# Altium schematic sheet POWER.SchDoc: TP5100, POWER PATH
size 420 x 297 mm; SheetNumber: 2; SheetTotal: 8
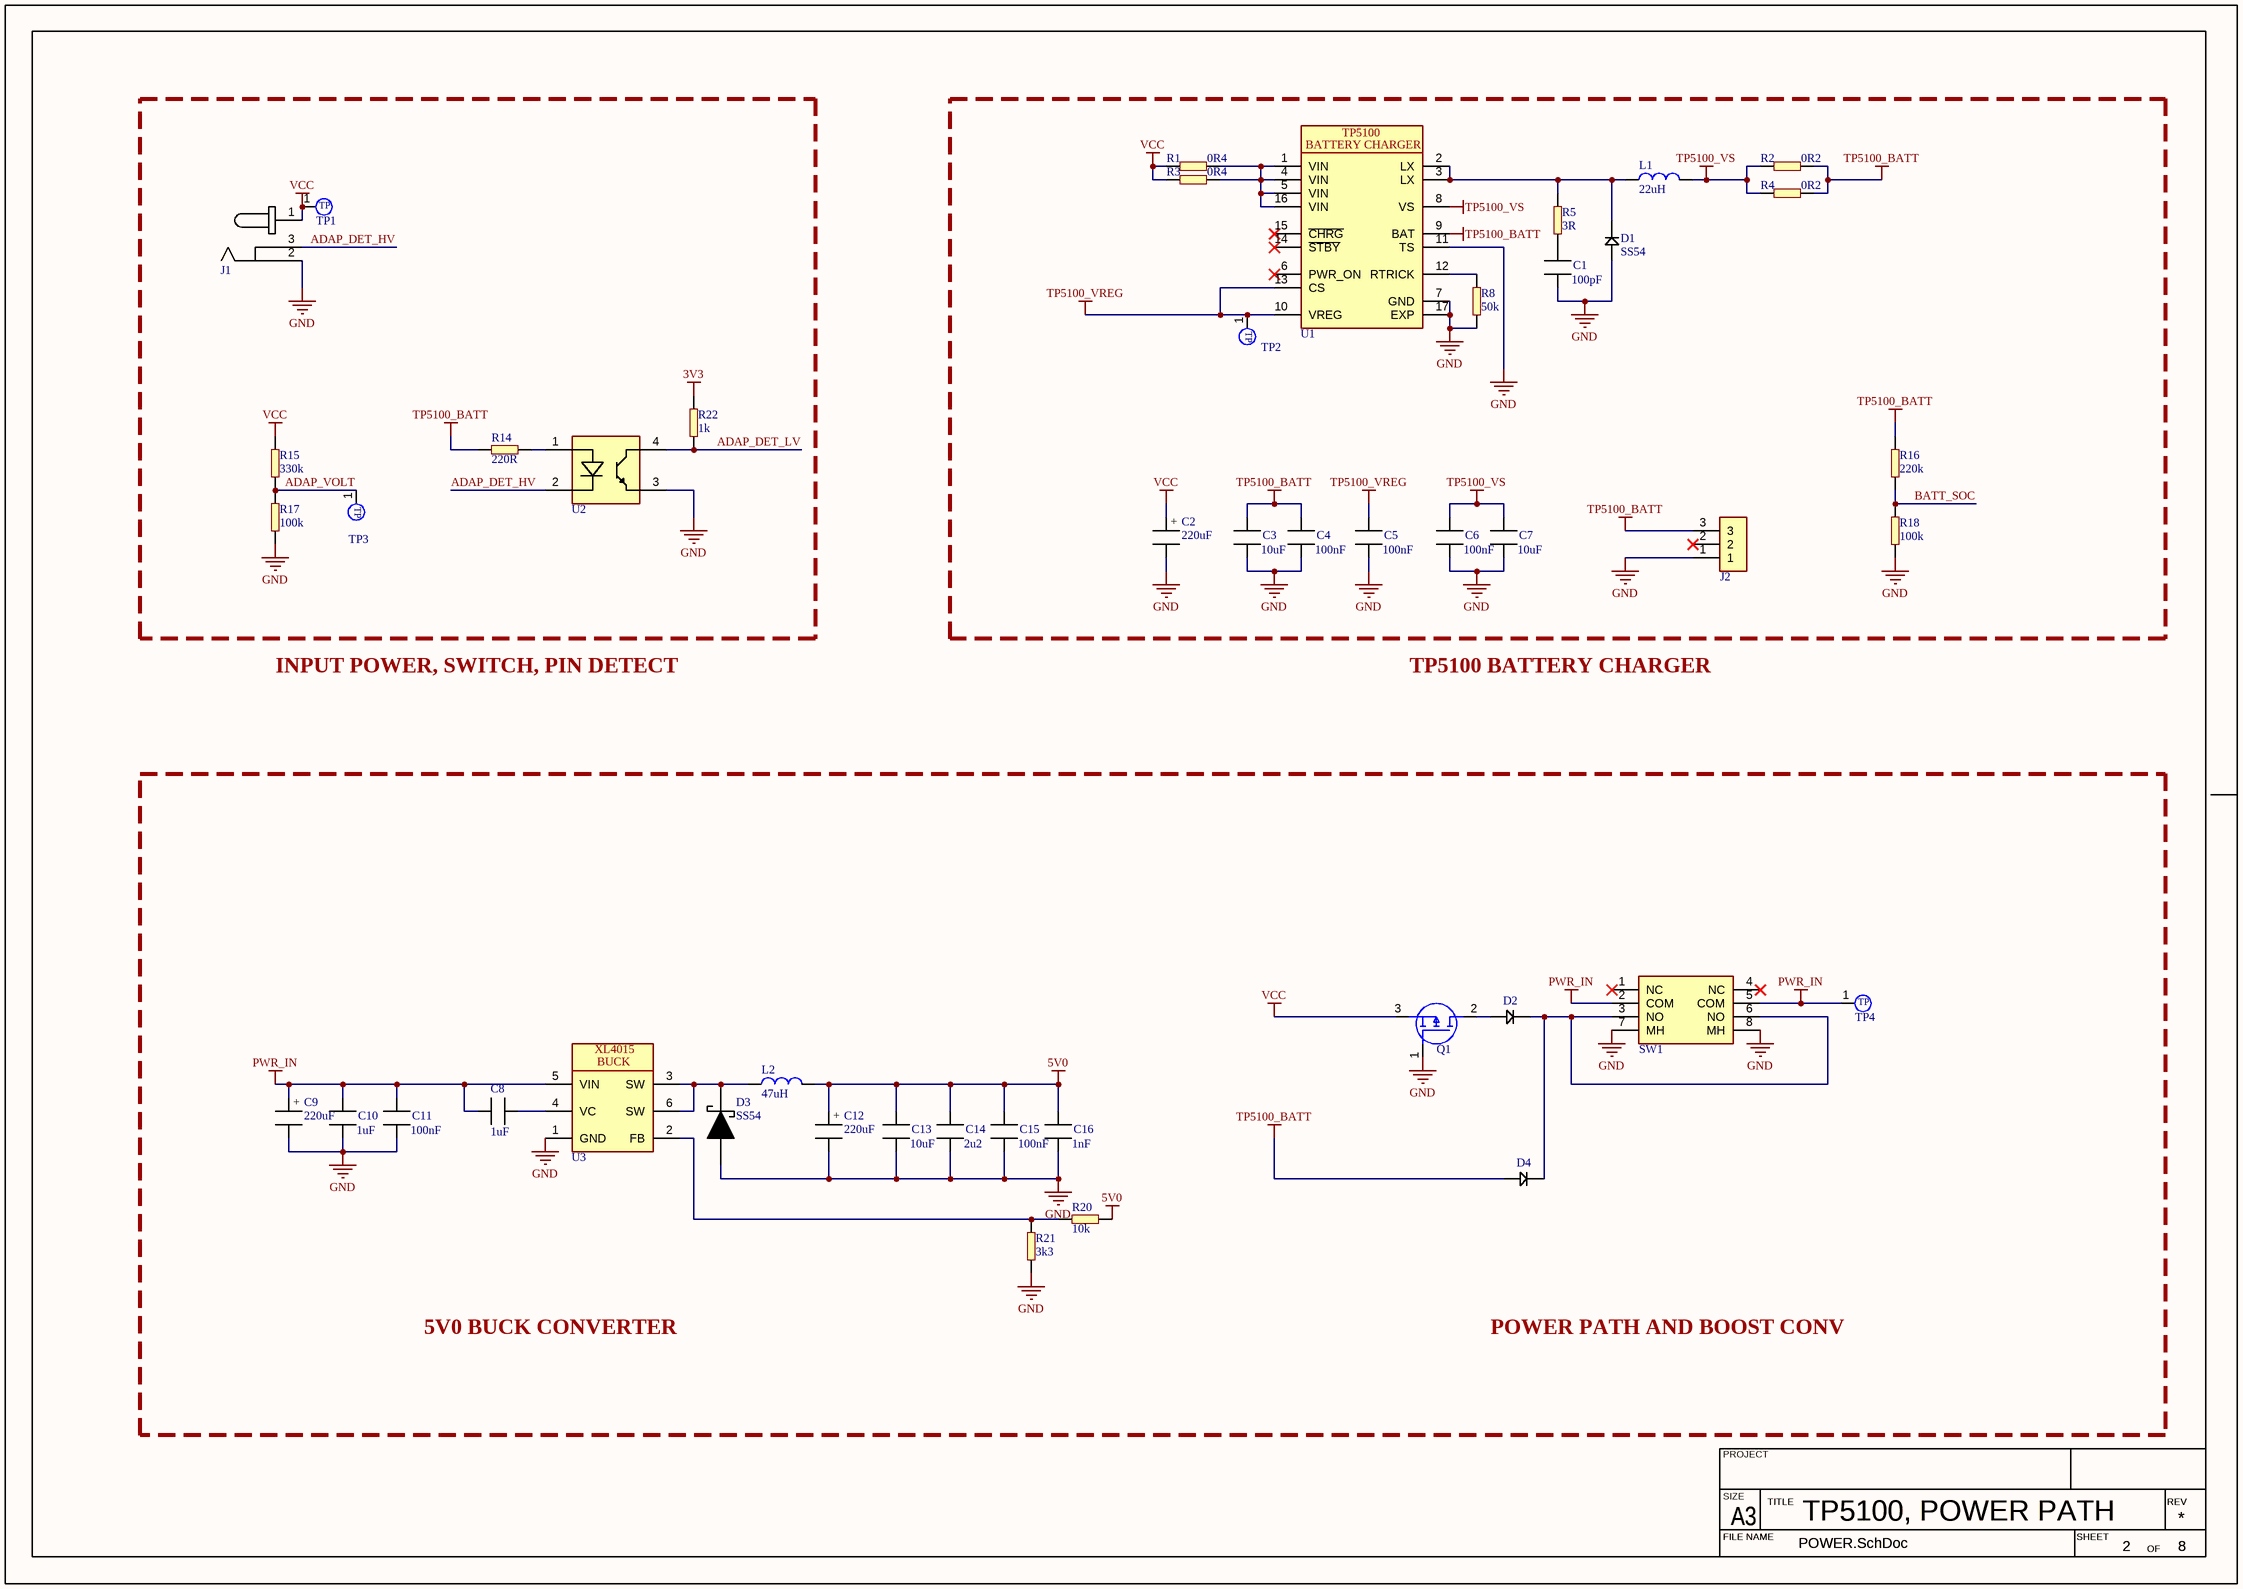
[diagram p0: POWER.SchDoc]

## Parts
C1  value 100pF  [CAPC2012X13L]  (hidden comment: MLCC_0805)
C2  value 220uF  [CAP_D10_H16_P5]  (hidden comment: ERP_102-2)
C3  value 10uF  [CAPC2012X13L]  (hidden comment: MLCC_0805)
C4  value 100nF  [CAPC2012X13L]  (hidden comment: MLCC_0805)
C5  value 100nF  [CAPC2012X13L]  (hidden comment: MLCC_0805)
C6  value 100nF  [CAPC2012X13L]  (hidden comment: MLCC_0805)
C7  value 10uF  [CAPC2012X13L]  (hidden comment: MLCC_0805)
C8  value 1uF  [CAPC2012X13L]  (hidden comment: MLCC_0805)
C9  value 220uF  [CAP_D10_H16_P5]  (hidden comment: ERP_102-2)
C10  value 1uF  [CAPC2012X13L]  (hidden comment: MLCC_0805)
C11  value 100nF  [CAPC2012X13L]  (hidden comment: MLCC_0805)
C12  value 220uF  [CAP_D10_H16_P5]  (hidden comment: ERP_102-2)
C13  value 10uF  [CAPC2012X13L]  (hidden comment: MLCC_0805)
C14  value 2u2  [CAPC2012X13L]  (hidden comment: MLCC_0805)
C15  value 100nF  [CAPC2012X13L]  (hidden comment: MLCC_0805)
C16  value 1nF  [CAPC2012X13L]  (hidden comment: MLCC_0805)
D1  value SS54  [DIOM6959X26L]  (hidden comment: ERP_104-3)
D2  ERP_104-3  [DIOM6959X26L]  (value not drawn)
D3  value SS54  [DIOM6959X26L]  (hidden comment: ERP_104-3)
D4  ERP_104-3  [DIOM6959X26L]  (value not drawn)
J1  KLDX-0202-AC  [KLDX-0202-AC]  (value not drawn)
J2  Molex_5.08_3P  [Molex_5.08_3P]  (value not drawn)
L1  value 22uH  [IND_1212]  (hidden comment: IND_1212)
L2  value 47uH  [IND_1212]  (hidden comment: ERP_103-3)
Q1  IRFR5305TRPBF  [DPAK229P991X239-3M]  (value not drawn)
R1  value 0R4  [RESC3116X06M]  (hidden comment: RES_1206)
R2  value 0R2  [RESC3116X06M]  (hidden comment: RES_1206)
R3  value 0R4  [RESC3116X06M]  (hidden comment: RES_1206)
R4  value 0R2  [RESC3116X06M]  (hidden comment: RES_1206)
R5  value 3R  [RES_0603]  (hidden comment: ERP_101-1)
R8  value 50k  [RES_0603]  (hidden comment: ERP_101-1)
R14  value 220R  [RES_0603]  (hidden comment: ERP_101-1)
R15  value 330k  [RES_0603]  (hidden comment: ERP_101-1)
R16  value 220k  [RES_0603]  (hidden comment: ERP_101-1)
R17  value 100k  [RES_0603]  (hidden comment: ERP_101-1)
R18  value 100k  [RES_0603]  (hidden comment: ERP_101-1)
R20  value 10k  [RES_0603]  (hidden comment: ERP_101-1)
R21  value 3k3  [RES_0603]  (hidden comment: ERP_101-1)
R22  value 1k  [RES_0603]  (hidden comment: ERP_101-1)
SW1  ERP_110-4  [PBH2U]  (value not drawn)
TP1  TP_1MM  [TP_1MM]  (value not drawn)  (no BOM)
TP2  TP_1MM  [TP_1MM]  (value not drawn)  (no BOM)
TP3  TP_1MM  [TP_1MM]  (value not drawn)  (no BOM)
TP4  TP_1MM  [TP_1MM]  (value not drawn)  (no BOM)
U1  TP5100  [QFN65P400X400X90_HS-17M]  (value not drawn)
U2  FOD817A3SD  [FOD817A3SD]  (value not drawn)
U3  XL4015  [XL4015]  (value not drawn)

## Nets
3V3: R22.2
5V0: C12.1 C13.1 C14.1 C15.1 C16.1 L2.1 R20.1
GND: C1.2 C2.2 C3.2 C4.2 C5.2 C6.2 C7.2 C9.2 C10.2 C11.2 C12.2 C13.2 C14.2 C15.2 C16.2 D1.2(A) D3.2(A) J1.2 J2.1 Q1.1(G) R8.1 R17.2 R18.1 R21.2 SW1.7(MH) SW1.8(MH) U1.7(GND) U1.11(TS) U1.17(EXP) U2.3(EMITTER) U3.1(GND)
PWR_IN: C8.1 C9.1 C10.1 C11.1 SW1.2(COM) SW1.5(COM) TP4.1 U3.5(VIN)
TP5100_BATT: C3.1 C4.1 D4.2(A) J2.3 R2.1 R4.1 R14.1 R16.2 U1.9(BAT)
TP5100_VREG: C5.1 TP2.1 U1.10(VREG) U1.13(CS)
TP5100_VS: C6.1 C7.1 L1.2 R2.2 R4.2 U1.8(VS)
VCC: C2.1 J1.1 Q1.3(S) R1.2 R3.2 R15.2 TP1.1
ADAP_DET_HV: J1.3 U2.2(CATHODE)
ADAP_DET_LV: R22.1 U2.4(COLLECTOR)
ADAP_VOLT: R15.1 R17.1 TP3.1
BATT_SOC: R16.1 R18.2
NetC1_1: C1.1 R5.1
NetC8_2: C8.2 U3.4(VC)
NetD1_1: D1.1(C) L1.1 R5.2 U1.2(LX) U1.3(LX)
NetD2_1: D2.1(C) D4.1(C) SW1.3(NO) SW1.6(NO)
NetD2_2: D2.2(A) Q1.2(D)
NetD3_1: D3.1(C) L2.2 U3.3(SW) U3.6(SW)
NetR1_1: R1.1 R3.1 U1.1(VIN) U1.4(VIN) U1.5(VIN) U1.16(VIN)
NetR8_2: R8.2 U1.12(RTRICK)
NetR14_2: R14.2 U2.1(ANODE)
NetR20_2: R20.2 R21.1 U3.2(FB)

Not connected (* = marked no-connect by the designer): J2 2*; SW1 1(NC)* 4(NC)*; U1 6(PWR_ON)* 14(~{STBY})* 15(~{CHRG})*

## Notes on the sheet
- INPUT POWER, SWITCH, PIN DETECT
- TP5100 BATTERY CHARGER
- 5V0 BUCK CONVERTER
- POWER PATH AND BOOST CONV
- PROJECT
- SIZE
- FILE NAME
- A3
- TITLE
- SHEET
- OF
- REV
- (in symbol CAP_D10_H16_P5) +
- (in symbol TP5100) BATTERY CHARGER
- (in symbol TP_1MM) TP
- (in symbol XL4015) BUCK

## Library data of the parts
C1 C11 C14-C16 = MLCC_0805: Chip Capacitor, 2-Leads, Body 2.00x1.25mm, IPC High Density; Package: 0805; Manufacturer 1: *; Manufacturer Part Number 1: *
C2 C9 C12 = CAP_D10_H16_P5: Electrolytic Capacitor Through Hole D10 P5.0; Package: 10X5; Manufacturer 1: *; Manufacturer Part Number 1: *; Supplier 1: *
C3-C8 C10 C13 = MLCC_0805: 1uF 105 0805 (2012 metric) 50V X7R MLCC SMD; Package: 0805; Manufacturer 1: *; Manufacturer Part Number 1: *
D1 D3 = SS54: Supplier Part Number 1: *; Supplier  1: *; Package: SMC; Manufacturer Part Number 1: *; Manufacturer 1: *
  D3: ERP: *
D2 D4 = SS54: Value: SS54; Supplier Part Number 1: *; Supplier  1: *; Package: SMC; Manufacturer Part Number 1: *; Manufacturer 1: *
J1 = KLDX-0202-AC: CONN PWR JACK 2X5.5MM KINKED PIN; Manufacturer 1: Sharvi; Manufacturer Part Number 1: ST2001CO0701; Value: NA
J2 = Molex_5.08_3P: Molex 7A 5.08mm Connector 3 Pin; Manufacturer Part Number 1: *; Manufacturer 1: *; Value: *
L2 = IND_1212: Manufacturer 1: Würth Elektronik; Manufacturer Part Number 1: *
Q1 = IRFR5305TRPBF: P Channel MOSFET -55V HEXFET 65mOhms 42nC TO-252-3; Manufacturer 1: International Rectifier; Value: *; Supplier Part Number 1: *; Supplier 1: *; Manufacturer Part Number 1: IRFR5305TRPBF
R5 R8 R14-R18 R20-R22 = RES_0603: Package: 0603; Manufacturer 1: *; Manufacturer Part Number 1: *
SW1 = PBH2U: Pushbutton Switch DPDT Standard Through Hole, Right Angle; Manufacturer Part Number 1: ST2106CO3161; Manufacturer 1: Sharvi; Package: *; Value: *
U1 = TP5100: Switching-buck type (double 8.4V / single 4.2V) lithium battery charging management chip; Manufacturer 1: Top Power; Value: *; Manufacturer Part Number 1: TP5100; Supplier 1: *; Supplier Part Number 1: *
U2 = FOD817A3SD: OPTOISOLATOR 5KV TRANSISTOR 4SMD; Value: *; Manufacturer: *; Manufacturer Part Number 1: *
U3 = XL4015: 5A 180KHz 36V Buck DC to DC Converter; Manufacturer 1: XLSemi; Manufacturer Part Number 1: XL4015E1; Value: *
L1 = IND_1212: Manufacturer Part Number 1: *; Manufacturer 1: *; Supplier 1: *; Supplier Part Number 1: *
R1-R4 = RES_1206: Package: 1206; Manufacturer 1: *; Manufacturer Part Number 1: *; Supplier Part Number 1: *; Supplier 1: *